# EAGLE design Ctrl_core_teensy32 (EAGLE 9.2.2)
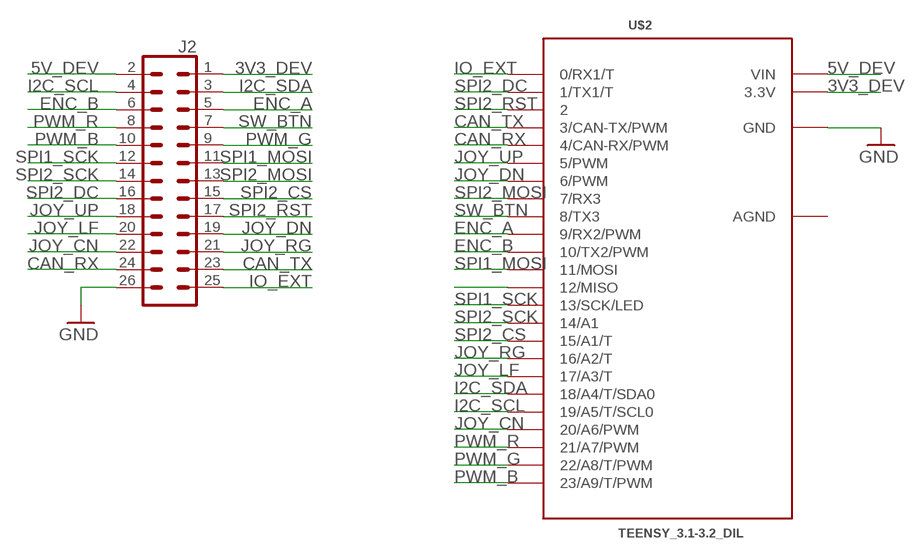
[diagram p0: schematic, sheet 1]

## Parts
J2  CONN_13X22X13  [2X13]
U$2  TEENSY_3.1-3.2_DIL  [TEENSY_3.0-3.2&LC_DIL]

## Nets
3V3_DEV: J2.1 U$2.3.3V
5V_DEV: J2.2 U$2.VIN
CAN_RX: J2.24 U$2.4(4/CAN-RX/PWM)
CAN_TX: J2.23 U$2.3(3/CAN-TX/PWM)
ENC_A: J2.5 U$2.9(9/RX2/PWM)
ENC_B: J2.6 U$2.10(10/TX2/PWM)
GND: J2.26 U$2.GND
I2C_SCL: J2.4 U$2.19/A5(19/A5/T/SCL0)
I2C_SDA: J2.3 U$2.18/A4(18/A4/T/SDA0)
IO_EXT: J2.25 U$2.0(0/RX1/T)
JOY_CN: J2.22 U$2.20/A6(20/A6/PWM)
JOY_DN: J2.19 U$2.6(6/PWM)
JOY_LF: J2.20 U$2.17/A3(17/A3/T)
JOY_RG: J2.21 U$2.16/A2(16/A2/T)
JOY_UP: J2.18 U$2.5(5/PWM)
N$13: U$2.12(12/MISO)
PWM_B: J2.10 U$2.23/A9(23/A9/T/PWM)
PWM_G: J2.9 U$2.22/A8(22/A8/T/PWM)
PWM_R: J2.8 U$2.21/A7(21/A7/PWM)
SPI1_MOSI: J2.11 U$2.11(11/MOSI)
SPI1_SCK: J2.12 U$2.13(13/SCK/LED)
SPI2_CS: J2.15 U$2.15/A1(15/A1/T)
SPI2_DC: J2.16 U$2.1(1/TX1/T)
SPI2_MOSI: J2.13 U$2.7(7/RX3)
SPI2_RST: J2.17 U$2.2
SPI2_SCK: J2.14 U$2.14/A0(14/A1)
SW_BTN: J2.7 U$2.8(8/TX3)

## Power pins joined to a net without a drawn wire
AGND: U$2.AGND

## Library data of the parts
J2 = Ctrl:CONN_13X2: Multi connection point. Often used as Generic Header-pin footprint for 0.1 inch spaced/style header connections On any of the 0.1 inch spaced packages, you can populate with these: Break Away Headers - Straight <https://www.sparkfun.com/products/116> (PRT-00116) Break Away Male Headers - Right Angle <https://www.sparkfun.com/products/553> (PRT-00553) Female Headers <https://www.sparkfun.com/products/115> (PRT-00115) Break Away Headers - Machine Pin <https://www.sparkfun.com/products/117> (PRT-00117) Break Away Female Headers - Swiss Machine Pin <https://www.sparkfun.com/products/743> (PRT-00743)
U$2 = Teensy_3_and_LC_Series_Boards_v1.4:TEENSY_3.1-3.2_DIL: Teensy 3.1 or 3.2 in a DIL Layout.

## Board
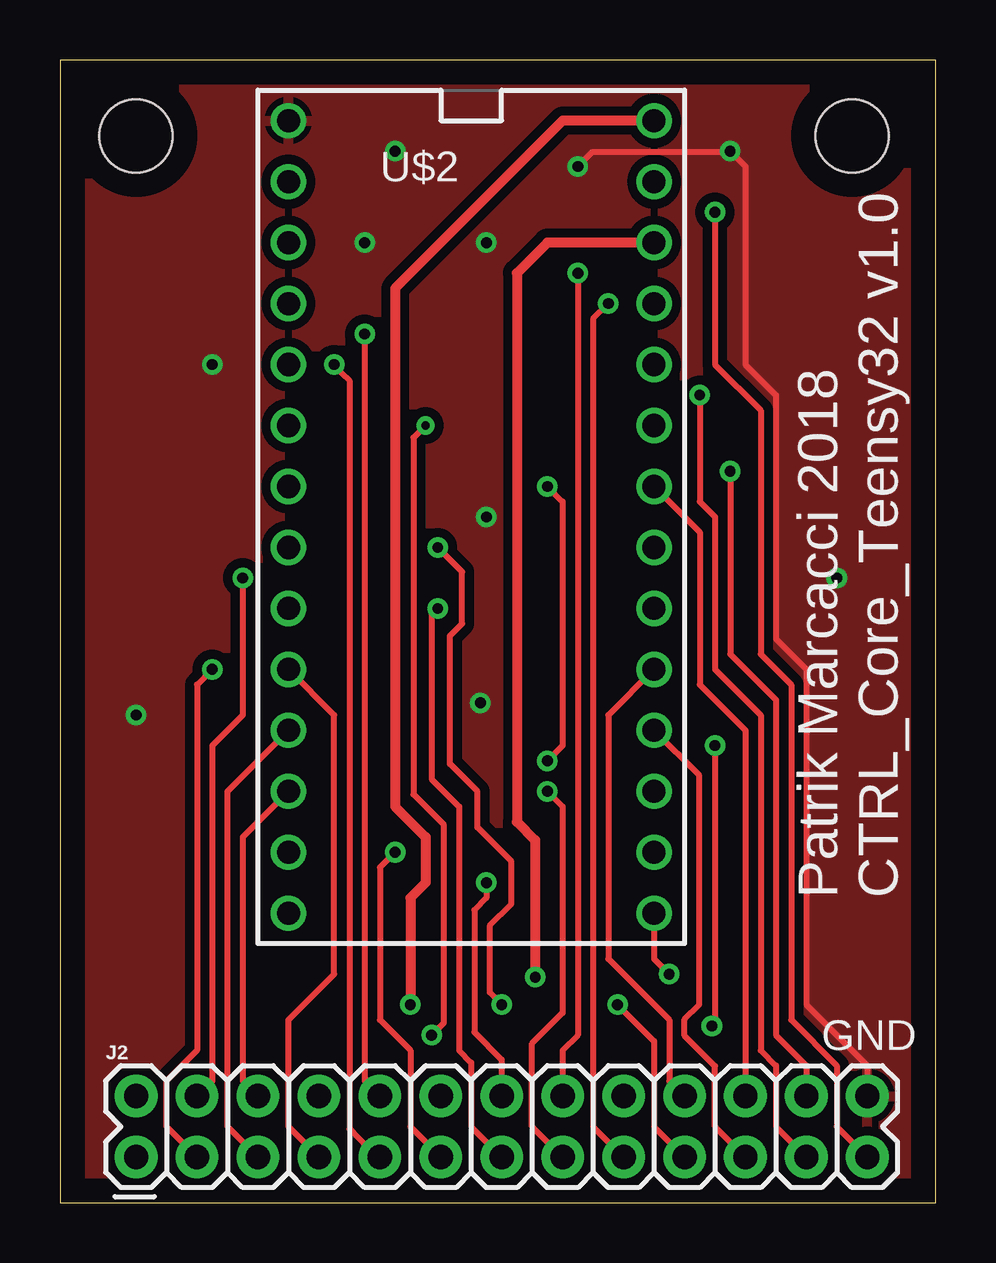
[diagram p1: board, top side]
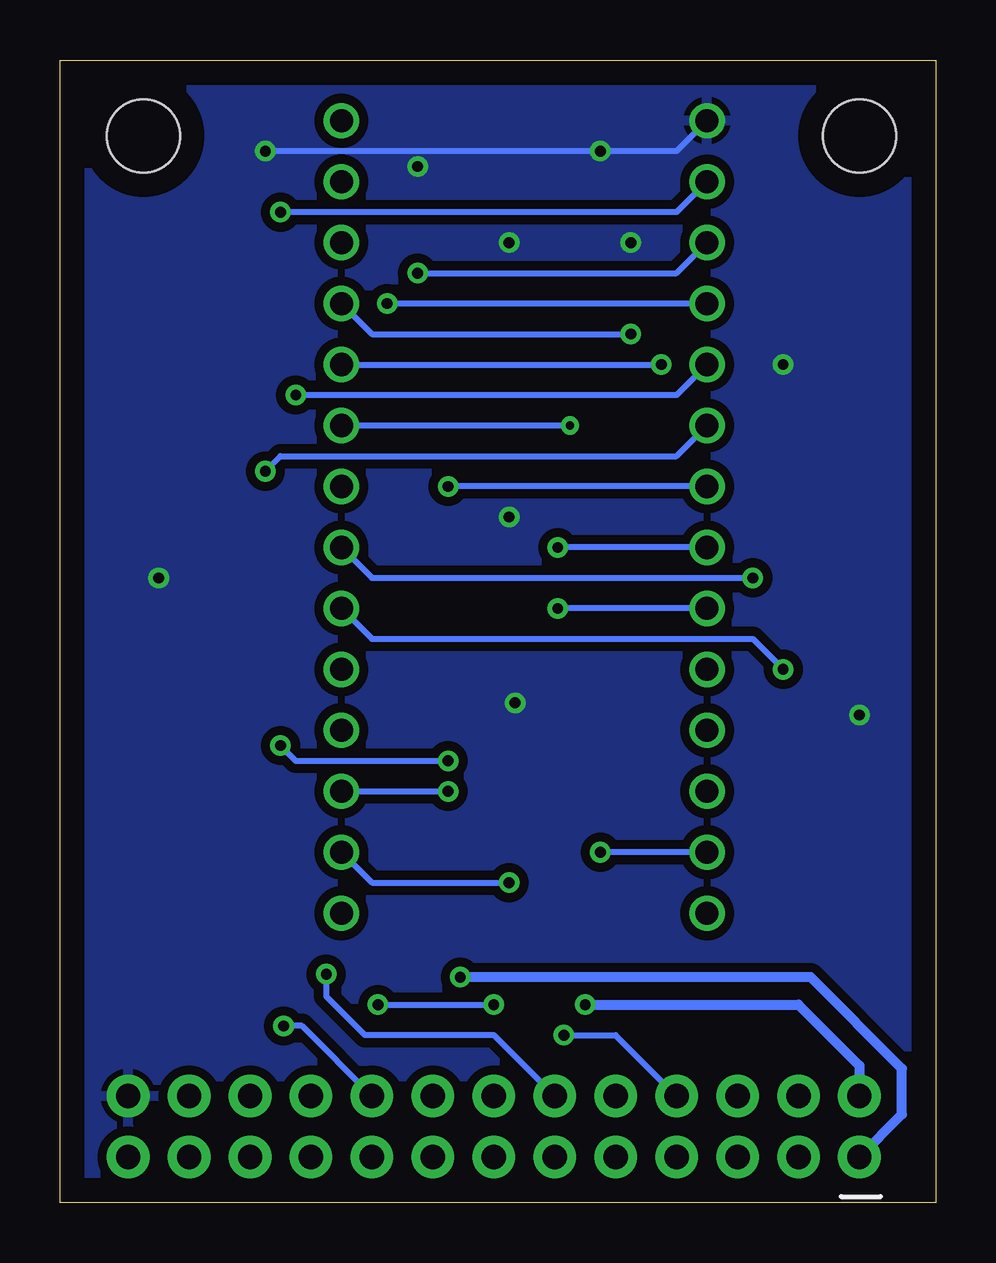
[diagram p2: board, bottom side, seen from below]

Size 36.5 x 47.62 mm. Coordinates in mm from the lower left corner, seen from the top.
Outline: 0,0 36.5,0 36.5,47.62 0,47.62 0,0
Copper layers (1*16): Top 0.035mm / dielectric 1.5mm / Bottom 0.035mm
Design rules "default *": minimum track width 6mil, minimum drill 0.35mm, track to track 15mil, track to pad 15mil, pad to pad 10mil, via to via 15mil, smd to smd 10mil, copper to edge 40mil, drill to drill 10mil, minimum pad ring 10mil, minimum via ring 8mil, stop-mask expansion 4mil, vias tented up to drill 0mil, thermal gap 10mil
Holes 3.05 mm at 3.17,44.45 33.02,44.45

### Footprints (pad centres in the part's own frame; a part is rotated, then mirrored left to right if it is on the bottom)
2X13 = drill 1.016 pad 1.778: 1 0,0; 2 0,2.54; 3 2.54,0; 4 2.54,2.54; 5 5.08,0; 6 5.08,2.54; 7 7.62,0; 8 7.62,2.54; 9 10.16,0; 10 10.16,2.54; 11 12.7,0; 12 12.7,2.54; 13 15.24,0; 14 15.24,2.54; 15 17.78,0; 16 17.78,2.54; 17 20.32,0; 18 20.32,2.54; 19 22.86,0; 20 22.86,2.54; 21 25.4,0; 22 25.4,2.54; 23 27.94,0; 24 27.94,2.54; 25 30.48,0; 26 30.48,2.54
TEENSY_3.0-3.2&LC_DIL = drill 0.965: 0 -7.62,13.97; 1 -7.62,11.43; 2 -7.62,8.89; 3 -7.62,6.35; 3.3V 7.62,11.43; 4 -7.62,3.81; 5 -7.62,1.27; 6 -7.62,-1.27; 7 -7.62,-3.81; 8 -7.62,-6.35; 9 -7.62,-8.89; 10 -7.62,-11.43; 11 -7.62,-13.97; 12 -7.62,-16.51; 13 7.62,-16.51; 14/A0 7.62,-13.97; 15/A1 7.62,-11.43; 16/A2 7.62,-8.89; 17/A3 7.62,-6.35; 18/A4 7.62,-3.81; 19/A5 7.62,-1.27; 20/A6 7.62,1.27; 21/A7 7.62,3.81; 22/A8 7.62,6.35; 23/A9 7.62,8.89; AGND 7.62,13.97; GND -7.62,16.51; VIN 7.62,16.51

### Placement (x,y rotation side)
J2  3.17,1.91 0 top
U$2  17.14,28.57 0 top

### Tracks (layer width: path | path; a pad name or v marks a point on that pad's centre or on a via)
3V3_DEV  (via drill 0.45)
  Top 0.406: U$2.3.3V 20.32,40.01 19.05,38.73 19.05,15.88 19.81,15.11 v19.81,9.4
  Bottom 0.406: v19.81,9.4 5.21,9.4 1.4,5.59 1.4,3.68 J2.1
5V_DEV  (via drill 0.45)
  Top 0.406: U$2.VIN 20.95,45.09 13.97,38.1 13.97,16.51 15.24,15.24 15.24,13.34 14.61,12.7 v14.61,8.26
  Bottom 0.406: v14.61,8.26 5.71,8.26 3.17,5.71 J2.2
CAN_RX  (via drill 0.45)
  Top 0.254: J2.24 31.12,5.71 29.84,6.99 29.84,20.95 27.94,22.86 v27.94,30.48
  Bottom 0.254: U$2.4 10.79,31.11 27.3,31.11 v27.94,30.48
CAN_TX  (via drill 0.45)
  Top 0.254: J2.23 29.84,3.17 29.84,5.71 29.21,6.35 29.21,20.32 27.3,22.22 27.3,28.57 26.67,29.21 v26.67,33.66
  Bottom 0.254: U$2.3 10.79,33.66 v26.67,33.66
ENC_A
  Top 0.254: U$2.9 6.98,17.14 6.98,3.17 J2.5
ENC_B
  Top 0.254: J2.6 7.62,5.08 7.62,15.24 U$2.10
GND  (via drill 0.45)
  Top 0.254: J2.26 33.66,5.71 31.12,8.26 31.12,22.22 29.84,23.49 29.84,33.66 28.58,34.93 28.58,43.18 v27.94,43.82 27.91,43.79 22.2,43.79 v21.59,43.18
  Bottom 0.254: U$2.GND 10.79,43.82 v13.97,43.82 v27.94,43.82
  other vias: 32.38,26.04 6.35,34.93 12.7,40.01 17.78,40.01 3.17,20.32 17.78,28.57 17.53,20.83
  pour Top: 0,47.62 36.2,47.62 36.2,0 0,0
  pour Bottom: 0,47.62 36.83,47.62 36.83,0 0,0
I2C_SCL  (via drill 0.45)
  Top 0.254: J2.4 6.35,5.08 6.35,19.05 7.62,20.32 v7.62,26.04
  Bottom 0.254: U$2.19/A5 23.5,26.04 v7.62,26.04
I2C_SDA  (via drill 0.45)
  Top 0.254: J2.3 4.45,3.17 4.45,5.08 5.71,6.35 5.71,21.59 v6.35,22.22
  Bottom 0.254: U$2.18/A4 23.5,23.49 7.62,23.49 v6.35,22.22
IO_EXT  (via drill 0.45)
  Top 0.254: J2.25 32.38,3.17 32.38,5.71 30.48,7.62 30.48,21.59 29.21,22.86 29.21,33.02 27.3,34.93 v27.3,41.27
  Bottom 0.254: U$2.0 10.79,41.27 v27.3,41.27
JOY_CN
  Top 0.254: U$2.20/A6 26.67,27.94 26.67,21.59 28.58,19.68 J2.22
JOY_DN  (via drill 0.45)
  Top 0.254: J2.19 24.77,3.17 24.77,6.73 v23.24,8.26 | v15.75,27.3 16.76,26.29 16.76,24.13 16.26,23.62 16.26,18.29 17.4,17.14 17.4,15.64 18.82,14.22 18.82,12.45 17.91,11.53 17.91,8.76 v18.41,8.26
  Bottom 0.254: U$2.6 v15.75,27.3 | v23.24,8.26 v18.41,8.26
JOY_LF
  Top 0.254: U$2.17/A3 22.86,20.32 22.86,10.16 25.4,7.62 25.4,5.08 J2.20
JOY_RG
  Top 0.254: U$2.16/A2 26.65,17.8 26.65,8.26 26.04,7.64 26.04,6.96 27.3,5.69 27.3,3.17 J2.21
JOY_UP  (via drill 0.45)
  Top 0.254: v20.32,29.84 20.95,29.21 20.95,19.05 v20.32,18.41 | v27.3,19.05 27.3,7.49 v27.18,7.37
  Bottom 0.254: U$2.5 v20.32,29.84 | v27.3,19.05 26.67,18.41 v20.32,18.41 | J2.18 26.42,7.37 v27.18,7.37
PWM_B  (via drill 0.45)
  Top 0.254: J2.10 12.7,5.08 v12.7,36.2
  Bottom 0.254: U$2.23/A9 23.5,36.2 v12.7,36.2
PWM_G  (via drill 0.45)
  Top 0.254: J2.9 13.21,1.91 12.07,3.07 12.07,34.26 11.43,34.87 v11.43,34.93
  Bottom 0.254: U$2.22/A8 v11.43,34.93
PWM_R  (via drill 0.35, 0.45)
  Top 0.254: v15.24,32.39 14.73,31.88 14.73,17.02 16,15.75 16,7.49 v15.49,6.99
  Bottom 0.254: v15.24,32.39 U$2.21/A7 | J2.8 13.34,6.99 v15.49,6.99
SPI1_MOSI  (via drill 0.45)
  Top 0.254: v13.97,14.61 13.34,13.97 13.34,7.62 14.61,6.35 14.61,3.17 J2.11
  Bottom 0.254: U$2.11 v13.97,14.61
SPI1_SCK  (via drill 0.45)
  Top 0.254: U$2.13 24.77,10.16 v25.4,9.53
  Bottom 0.254: J2.12 18.41,6.99 23.79,6.99 25.4,8.6 v25.4,9.53
SPI2_CS  (via drill 0.45)
  Top 0.254: J2.15 19.68,3.17 19.68,6.65 20.95,7.92 20.95,16.51 v20.32,17.14
  Bottom 0.254: U$2.15/A1 v20.32,17.14
SPI2_DC  (via drill 0.45)
  Top 0.254: v21.59,38.73 21.59,6.99 20.95,6.35 J2.16
  Bottom 0.254: v21.59,38.73 10.79,38.73 U$2.1
SPI2_MOSI  (via drill 0.45)
  Top 0.254: J2.13 17.14,3.17 17.14,5.84 16.64,6.35 16.64,16.51 15.49,17.65 15.49,24.51 v15.75,24.76
  Bottom 0.254: U$2.7 v15.75,24.76
SPI2_RST  (via drill 0.45)
  Top 0.254: v22.86,37.47 22.23,36.83 22.23,3.17 J2.17
  Bottom 0.254: U$2.2 v22.86,37.47
SPI2_SCK  (via drill 0.45)
  Top 0.254: J2.14 18.41,5.97 17.27,7.11 17.27,12.19 17.78,12.7 v17.78,13.34
  Bottom 0.254: U$2.14/A0 23.5,13.34 v17.78,13.34
SW_BTN
  Top 0.254: J2.7 9.53,3.17 9.53,7.62 11.43,9.53 11.43,20.32 U$2.8

### Text on the board
tPlace: Patrik Marcacci 2018 / CTRL_Core_Teensy32 v1.0 | GND